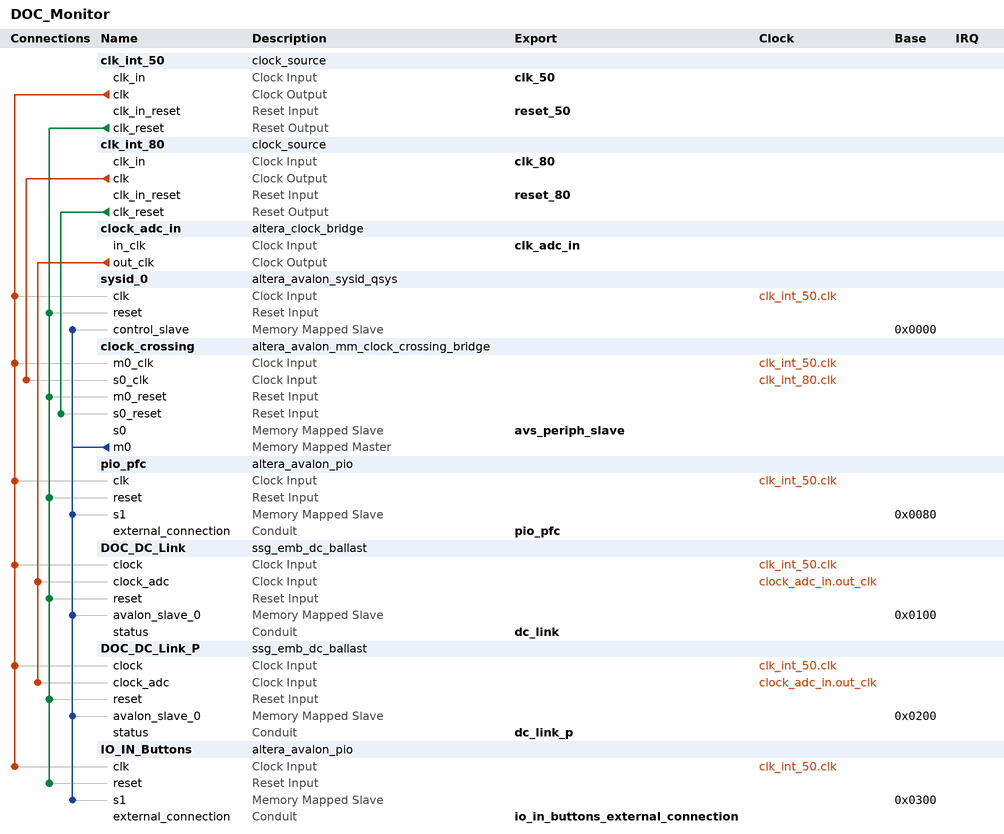
[diagram p0: system contents]
# Platform Designer (Qsys) system DOC_Monitor, Cyclone IV E EP4CE115F29C7
# Parameters at their usual value, and those the tool derives, are not listed.
package require -exact qsys 14.0
create_system DOC_Monitor
set_project_property DEVICE_FAMILY {Cyclone IV E}
set_project_property DEVICE EP4CE115F29C7

add_instance clk_int_50 clock_source 14.0
set_instance_parameter_value clk_int_50 clockFrequency 50000000

add_instance clk_int_80 clock_source 14.0
set_instance_parameter_value clk_int_80 clockFrequency 80000000

add_instance clock_adc_in altera_clock_bridge 14.0
set_instance_parameter_value clock_adc_in DERIVED_CLOCK_RATE 0
set_instance_parameter_value clock_adc_in EXPLICIT_CLOCK_RATE 20

add_instance sysid_0 altera_avalon_sysid_qsys 14.0
set_instance_parameter_value sysid_0 id 13709566

add_instance clock_crossing altera_avalon_mm_clock_crossing_bridge 14.0
set_instance_parameter_value clock_crossing DATA_WIDTH 32
set_instance_parameter_value clock_crossing ADDRESS_WIDTH 12
set_instance_parameter_value clock_crossing USE_AUTO_ADDRESS_WIDTH 0
set_instance_parameter_value clock_crossing MAX_BURST_SIZE 1
set_instance_parameter_value clock_crossing COMMAND_FIFO_DEPTH 2
set_instance_parameter_value clock_crossing RESPONSE_FIFO_DEPTH 2
set_instance_parameter_value clock_crossing MASTER_SYNC_DEPTH 3
set_instance_parameter_value clock_crossing SLAVE_SYNC_DEPTH 3

add_instance pio_pfc altera_avalon_pio 14.0
set_instance_parameter_value pio_pfc direction InOut
set_instance_parameter_value pio_pfc width 2

add_instance DOC_DC_Link ssg_emb_dc_ballast 1.1

add_instance DOC_DC_Link_P ssg_emb_dc_ballast 1.1

add_instance IO_IN_Buttons altera_avalon_pio 14.0
set_instance_parameter_value IO_IN_Buttons captureEdge true
set_instance_parameter_value IO_IN_Buttons direction Input
set_instance_parameter_value IO_IN_Buttons simDoTestBenchWiring true
set_instance_parameter_value IO_IN_Buttons width 4

# connections
add_connection clk_int_50.clk clock_crossing.m0_clk clock
add_connection clk_int_50.clk DOC_DC_Link.clock clock
add_connection clk_int_50.clk DOC_DC_Link_P.clock clock
add_connection clk_int_50.clk IO_IN_Buttons.clk clock
add_connection clk_int_50.clk pio_pfc.clk clock
add_connection clk_int_50.clk sysid_0.clk clock
add_connection clk_int_80.clk clock_crossing.s0_clk clock
add_connection clock_adc_in.out_clk DOC_DC_Link.clock_adc clock
add_connection clock_adc_in.out_clk DOC_DC_Link_P.clock_adc clock
add_connection clk_int_50.clk_reset clock_crossing.m0_reset reset
add_connection clk_int_50.clk_reset DOC_DC_Link.reset reset
add_connection clk_int_50.clk_reset DOC_DC_Link_P.reset reset
add_connection clk_int_50.clk_reset IO_IN_Buttons.reset reset
add_connection clk_int_50.clk_reset pio_pfc.reset reset
add_connection clk_int_50.clk_reset sysid_0.reset reset
add_connection clk_int_80.clk_reset clock_crossing.s0_reset reset
add_connection clock_crossing.m0 DOC_DC_Link.avalon_slave_0 avalon
set_connection_parameter_value clock_crossing.m0/DOC_DC_Link.avalon_slave_0 baseAddress 0x0100
add_connection clock_crossing.m0 DOC_DC_Link_P.avalon_slave_0 avalon
set_connection_parameter_value clock_crossing.m0/DOC_DC_Link_P.avalon_slave_0 baseAddress 0x0200
add_connection clock_crossing.m0 IO_IN_Buttons.s1 avalon
set_connection_parameter_value clock_crossing.m0/IO_IN_Buttons.s1 baseAddress 0x0300
add_connection clock_crossing.m0 pio_pfc.s1 avalon
set_connection_parameter_value clock_crossing.m0/pio_pfc.s1 baseAddress 0x0080
add_connection clock_crossing.m0 sysid_0.control_slave avalon
set_connection_parameter_value clock_crossing.m0/sysid_0.control_slave baseAddress 0x0000

# exported interfaces
add_interface io_in_buttons_external_connection conduit end
set_interface_property io_in_buttons_external_connection EXPORT_OF IO_IN_Buttons.external_connection
add_interface pio_pfc conduit end
set_interface_property pio_pfc EXPORT_OF pio_pfc.external_connection
add_interface dc_link conduit end
set_interface_property dc_link EXPORT_OF DOC_DC_Link.status
add_interface dc_link_p conduit end
set_interface_property dc_link_p EXPORT_OF DOC_DC_Link_P.status
add_interface clk_adc_in clock sink
set_interface_property clk_adc_in EXPORT_OF clock_adc_in.in_clk
add_interface avs_periph_slave avalon slave
set_interface_property avs_periph_slave EXPORT_OF clock_crossing.s0
add_interface clk_80 clock sink
set_interface_property clk_80 EXPORT_OF clk_int_80.clk_in
add_interface reset_80 reset sink
set_interface_property reset_80 EXPORT_OF clk_int_80.clk_in_reset
add_interface clk_50 clock sink
set_interface_property clk_50 EXPORT_OF clk_int_50.clk_in
add_interface reset_50 reset sink
set_interface_property reset_50 EXPORT_OF clk_int_50.clk_in_reset

set_interconnect_requirement {$system} qsys_mm.clockCrossingAdapter HANDSHAKE
set_interconnect_requirement {$system} qsys_mm.maxAdditionalLatency 0

save_system DOC_Monitor.qsys
